# Altium schematic sheet power.SchDoc
size A4; SheetNumber: 2; SheetTotal: 14
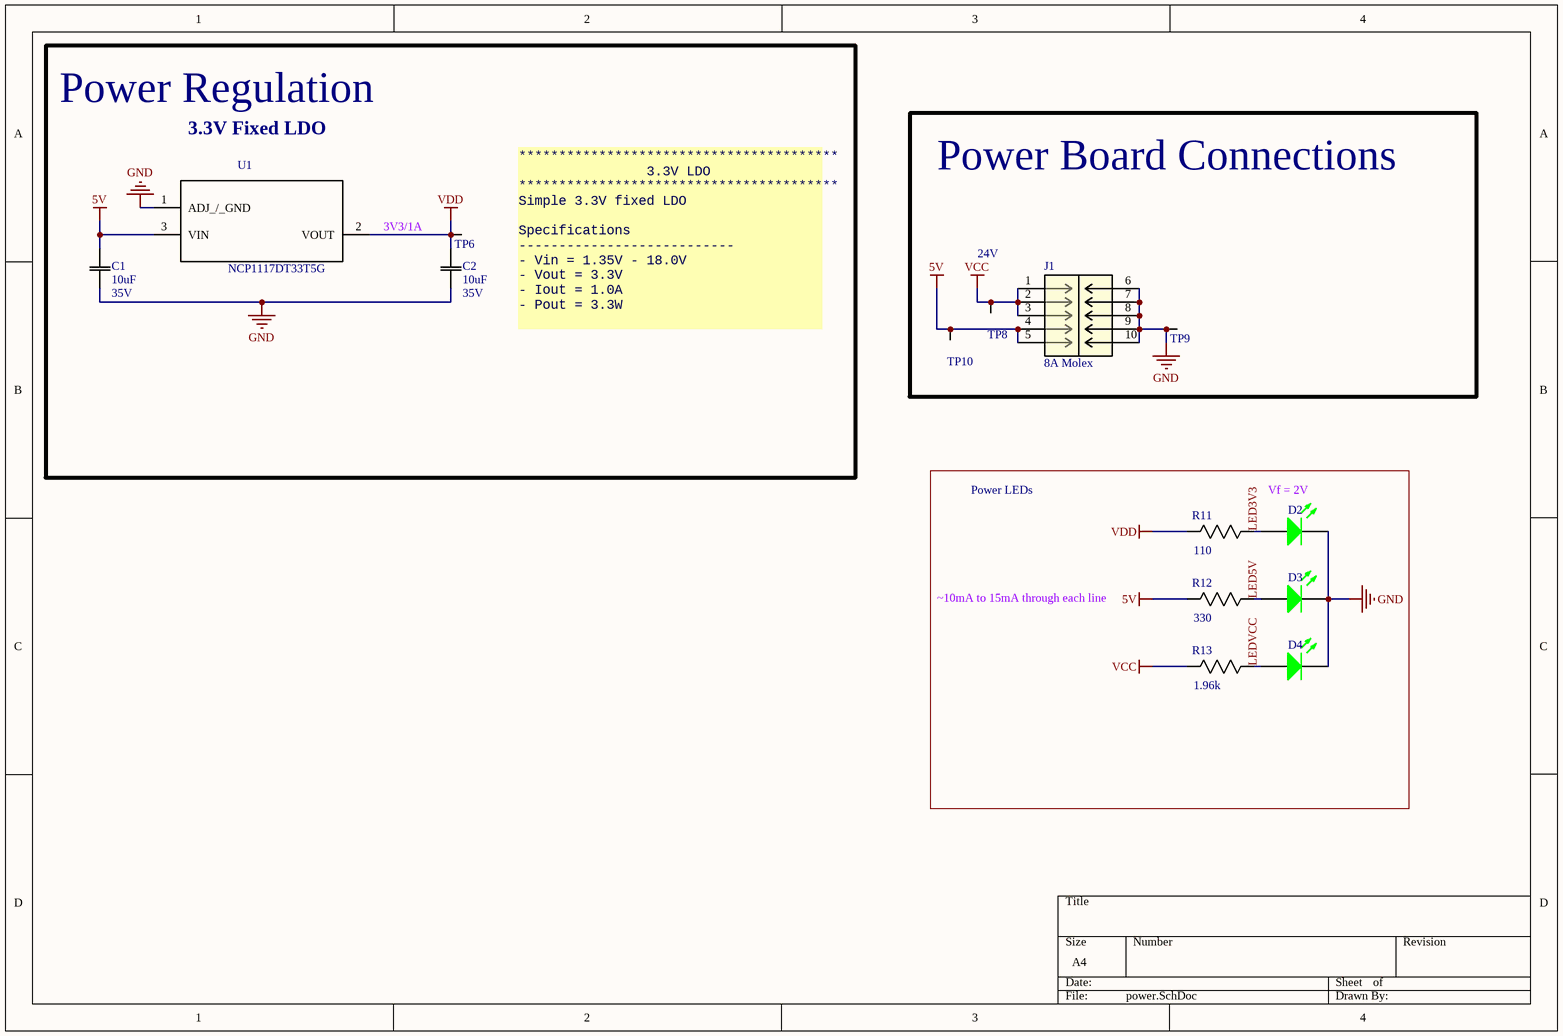
[diagram p0: power.SchDoc]

## Parts
C1  value 10uF  Rating: 35V  [0805]  (hidden comment: 10uF 35V)
C2  value 10uF  Rating: 35V  [0805]  (hidden comment: 10uF 35V)
D2  0603 2V  [0603 - LED]  (value not drawn)
D3  0603 2V  [0603 - LED]  (value not drawn)
D4  0603 2V  [0603 - LED]  (value not drawn)
J1  8A Molex  [MOLEX_0430451012]
R11  110  [0603]
R12  330  [0603]
R13  1.96k  [0603]
TP6  VDD  [TP]  (value not drawn)  (no BOM)
TP8  VCC  [TP]  (value not drawn)  (no BOM)
TP9  GND  [TP]  (value not drawn)  (no BOM)
TP10  5V  [TP]  (value not drawn)  (no BOM)
U1  NCP1117DT33T5G  [DPAK (TO-252)]

## Blocks framed on the sheet
Power Regulation: C1 C2 TP6 U1
Power Board Connections: J1 TP8-TP10

## Nets
5V: C1.2(C2) J1.4 J1.5 R12.2(R2) TP10.1 U1.3(VIN)
GND: C1.1(C1) C2.1(C1) D2.2(K) D3.2(K) D4.2(K) J1.6 J1.7 J1.8 J1.9 J1.10 TP9.1 U1.1(ADJ_/_GND)
VCC: J1.1 J1.2 J1.3 R13.2(R2) TP8.1
VDD: C2.2(C2) R11.2(R2) TP6.1 U1.2(VOUT)
LED3V3: D2.1(A) R11.1(R1)
LED5V: D3.1(A) R12.1(R1)
LEDVCC: D4.1(A) R13.1(R1)

## Notes on the sheet
- 3.3V Fixed LDO
- 3V3/1A
- 24V
- ****************************************
  3.3V LDO
  ****************************************
  Simple 3.3V fixed LDO
  Specifications
  ---------------------------
  - Vin = 1.35V - 18.0V
  - Vout = 3.3V
  - Iout = 1.0A
  - Pout = 3.3W
- Power LEDs
- Vf = 2V
- ~10mA to 15mA through each line

## Library data of the parts
C1 C2 = CAP 10uF 35V_1: Default Symbol for Capacitors; Manufacturer Part Number 1: C2012X5R1V106K125AC; Tolerance: 10%; Temperature Coefficient: X5R; Part Number: CAP 10uF 35V_1; Supplier 1: Digi-Key; Supplier Part Number 1: 445-14418-1-ND
D2-D4 = LED GREEN SMD 0603: LED Uni-Color Green 574nm 2-Pin Chip LED T/R; Manufacturer Part Number 1: LTST-C190KGKT; Current Rating: 20mA; Part Number: LED GREEN SMD 0603; Supplier 1: Digi-Key; Supplier Part Number 1: 160-1435-1-ND; Supplier URL 1: https://www.digikey.ca/en/products/detail/lite-on-inc/LTST-C190KGKT/386815?s=N4IgTCBcDaIIwDYAMBaOAWAzAVjSgcgCIgC6AvkA; Pin Count: 2; Voltage Rating - DC: 2V
J1 = CN HDR 10POS MOLEX 0430451012: CONN HEADER VERT 10POS 3MM; Supplier 1: Digi-Key; Supplier Part Number 1: WM1793-ND; Part Number: CN HDR 10POS MOLEX 0430451012; Supplier URL 1: https://www.digikey.ca/en/products/detail/molex/0430451012/252506?s=N4IgTCBcDaIAwBYDMiCsBGO6IF0C%2BQA; Pin Count: 10; Manufacturer Part Number 1: 0430451012
R11 = RES 110.0 1/8W - 1%: Default Resistor Symbol; Manufacturer Part Number 1: RMCF0603FT110R; Power (Watts): 0.125W; Tolerance: 1%; Package: 0805; Value: 110; Part Number: RES 110.0 1/8W - 1%; Supplier 1: Digi-Key; Supplier Part Number 1: RMCF0603FT110RCT-ND; Supplier URL 1: https://www.digikey.ca/en/products/detail/stackpole-electronics-inc/RMCF0603FT110R/1761268
R12 = RES 330.0 1/8W - 5%: Default Resistor Symbol; Manufacturer Part Number 1: RMCF0603JT330R; Power (Watts): 0.125W; Tolerance: 5%; Package: 0805; Value: 330; Part Number: RES 330.0 1/8W - 5%; Supplier 1: Digi-Key; Supplier Part Number 1: RMCF0603JT330RCT-ND; Supplier URL 1: https://www.digikey.ca/en/products/detail/stackpole-electronics-inc/RMCF0603JT330R/1757998
R13 = RES 1.96k 1/8W: Default Resistor Symbol; Manufacturer Part Number 1: RC0603FR-071K96L; Power (Watts): 0.125W; Tolerance: 1%; Package: 0805; Value: 1.96k; Part Number: RES 1.96k 1/8W; Supplier 1: Digi-Key; Supplier Part Number 1: 311-1.96KHRCT-ND; Supplier URL 1: https://www.digikey.ca/en/products/detail/yageo/RC0603FR-071K96L/726878
TP6 TP8-TP10 = Test Point (Via): Part Number: Test Point (Via)
U1 = NCP1117DT33T5G: Linear Voltage Regulator IC Positive Fixed 1 Output 1A DPAK; Part Number: NCP1117DT33T5G; Manufacturer Part Number 1: NCP1117DT33T5G; Supplier 1: Digi-Key; Supplier Part Number 1: NCP1117DT33T5GOSCT-ND; Supplier URL 1: https://www.digikey.ca/en/products/detail/onsemi/NCP1117DT33T5G/921285